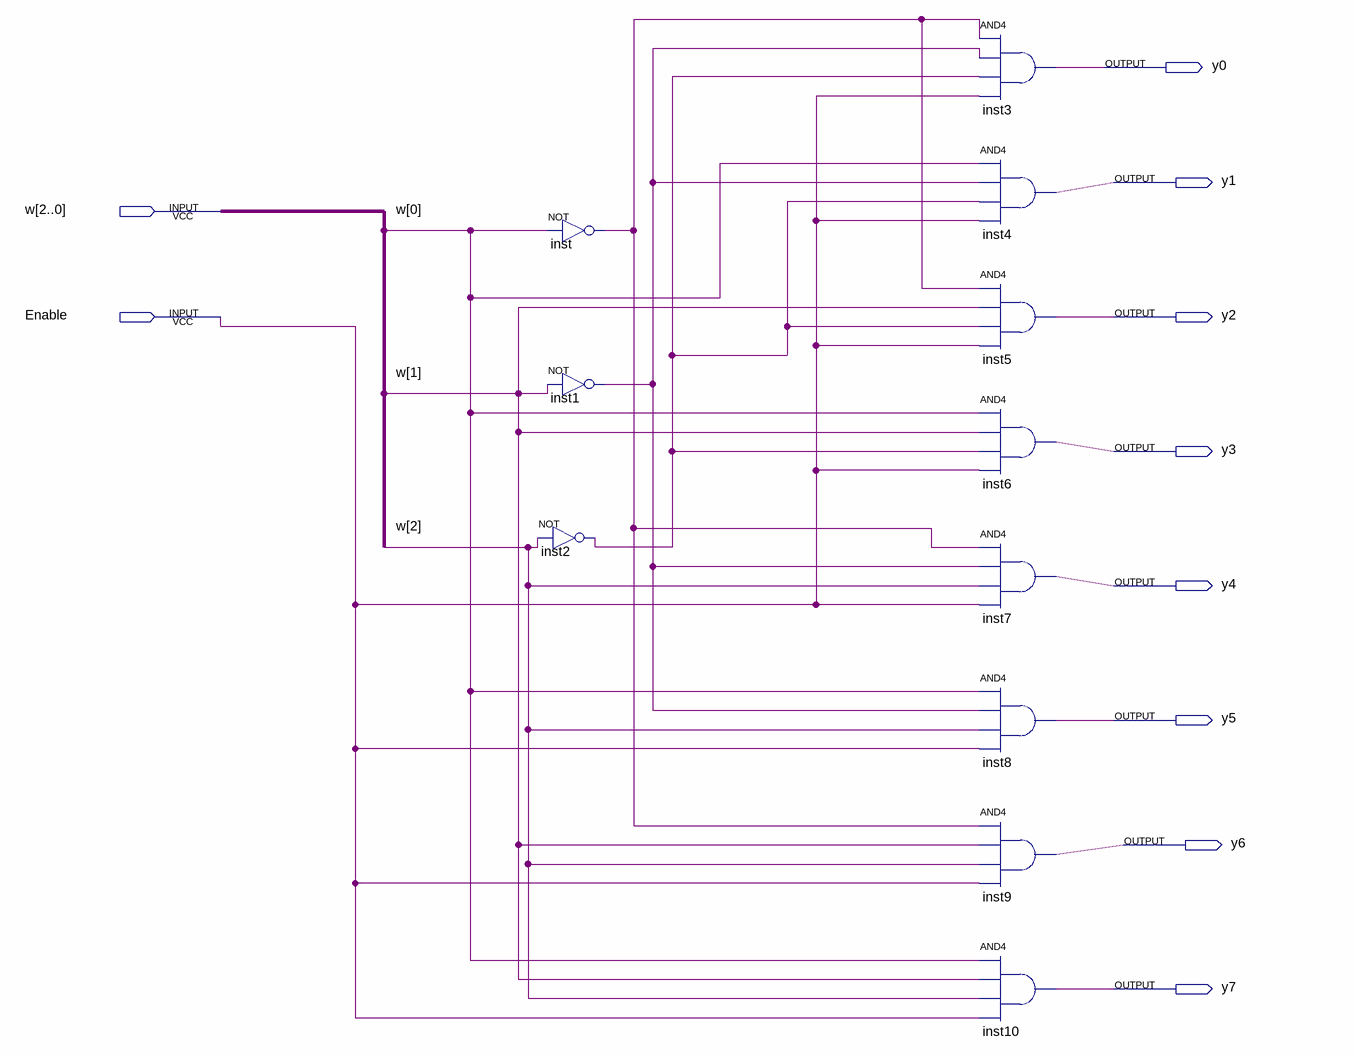
[diagram p0: schematic sheet]
// Quartus schematic 3-8Decoder.bdf as structural Verilog: 11 symbols, 10 pins
module \3-8Decoder  (
  input  [2:0] w,
  input  Enable,
  output y0,
  output y1,
  output y2,
  output y3,
  output y4,
  output y5,
  output y6,
  output y7
);

  wire inst1_out, inst2_out, inst_out;

  not inst2 (inst2_out, w[2]);
  not inst (inst_out, w[0]);
  not inst1 (inst1_out, w[1]);
  and inst3 (y0, inst_out, inst1_out, inst2_out, Enable);
  and inst4 (y1, w[0], inst1_out, inst2_out, Enable);
  and inst5 (y2, inst_out, w[1], inst2_out, Enable);
  and inst6 (y3, w[0], w[1], inst2_out, Enable);
  and inst7 (y4, inst_out, inst1_out, w[2], Enable);
  and inst8 (y5, w[0], inst1_out, w[2], Enable);
  and inst9 (y6, inst_out, w[1], w[2], Enable);
  and inst10 (y7, w[0], w[1], w[2], Enable);
endmodule
